# Altium project TECLADO-G5-5A.PrjPcb.PrjPcb
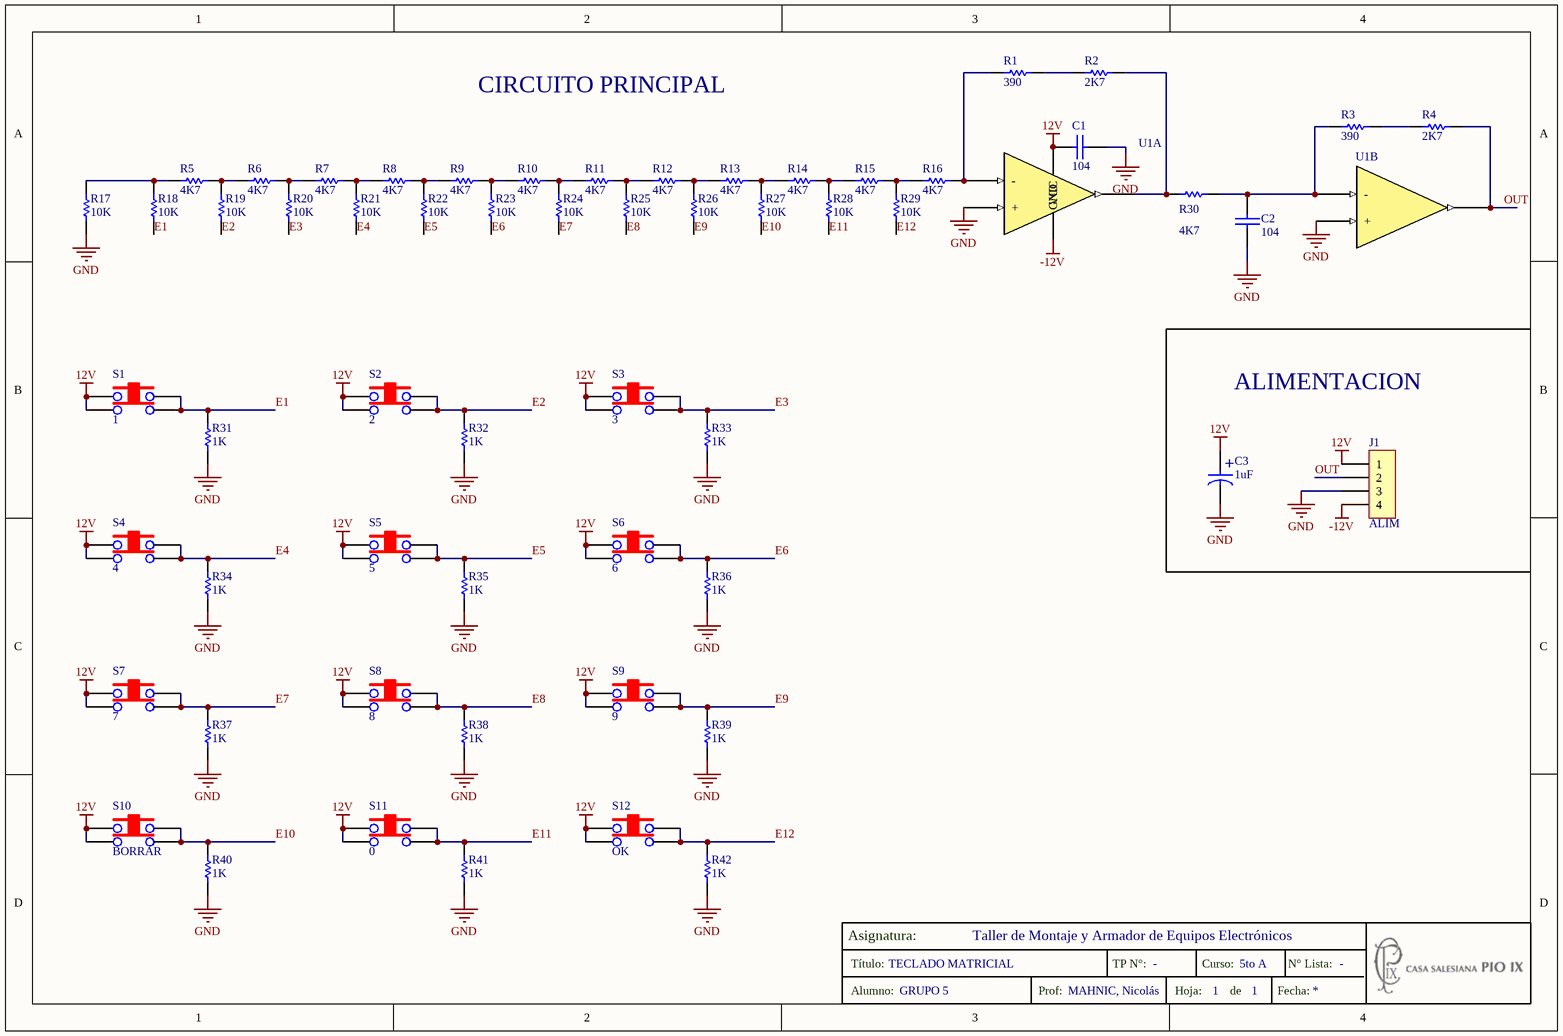
[diagram p0: TECLADO-G5-5A.schDoc.SchDoc]
1 sheet, 59 parts. Net scope: global (net labels, ports and power ports of the same name join across sheets).
Board file: TECLADO-G5-5A.pcbDoc.PcbDoc

## Sheet TECLADO-G5-5A.schDoc.SchDoc
size A4; SheetNumber: 1; SheetTotal: 1; Titulo: TECLADO MATRICIAL; Alumno: GRUPO 5; profesor: MAHNIC, Nicolás; curso: 5to A; TPN: -; NLista: -; Asignatura: Taller de Montaje y Armador de Equipos Electrónicos; Año: 2019; Rule: PcbType=ProtelPcb

### Parts
C1  104  [0805]
C2  104  [0805]
C3  1uF  [Capol]
J1  ALIM  [SIP4]
R1  390  [0805]
R2  2K7  [0805]
R3  390  [0805]
R4  2K7  [0805]
R5  4K7  [0805]
R6  4K7  [0805]
R7  4K7  [0805]
R8  4K7  [0805]
R9  4K7  [0805]
R10  4K7  [0805]
R11  4K7  [0805]
R12  4K7  [0805]
R13  4K7  [0805]
R14  4K7  [0805]
R15  4K7  [0805]
R16  4K7  [0805]
R17  10K  [0805]
R18  10K  [0805]
R19  10K  [0805]
R20  10K  [0805]
R21  10K  [0805]
R22  10K  [0805]
R23  10K  [0805]
R24  10K  [0805]
R25  10K  [0805]
R26  10K  [0805]
R27  10K  [0805]
R28  10K  [0805]
R29  10K  [0805]
R30  4K7  [0805]
R31  1K  [0805]
R32  1K  [0805]
R33  1K  [0805]
R34  1K  [0805]
R35  1K  [0805]
R36  1K  [0805]
R37  1K  [0805]
R38  1K  [0805]
R39  1K  [0805]
R40  1K  [0805]
R41  1K  [0805]
R42  1K  [0805]
S1  1  [pul_grande]
S2  2  [pul_grande]
S3  3  [pul_grande]
S4  4  [pul_grande]
S5  5  [pul_grande]
S6  6  [pul_grande]
S7  7  [pul_grande]
S8  8  [pul_grande]
S9  9  [pul_grande]
S10  BORRAR  [pul_grande]
S11  0  [pul_grande]
S12  OK  [pul_grande]
U1  (no value)  [LM358 SMD]  (parts A,B of 2)

### Nets
12V: C1.1 C3.1 J1.1 S1.1 S1.2 S2.1 S2.2 S3.1 S3.2 S4.1 S4.2 S5.1 S5.2 S6.1 S6.2 S7.1 S7.2 S8.1 S8.2 S9.1 S9.2 S10.1 S10.2 S11.1 S11.2 S12.1 S12.2 U1.8(VCC)
-12V: J1.4 U1.4(GND)
GND: C1.2 C2.2 C3.2 J1.3 R17.1 R31.1 R32.1 R33.1 R34.1 R35.1 R36.1 R37.1 R38.1 R39.1 R40.1 R41.1 R42.1 U1.3(+) U1.5(+)
E1: R18.1 R31.2 S1.3 S1.4
E2: R19.1 R32.2 S2.3 S2.4
E3: R20.1 R33.2 S3.3 S3.4
E4: R21.1 R34.2 S4.3 S4.4
E5: R22.1 R35.2 S5.3 S5.4
E6: R23.1 R36.2 S6.3 S6.4
E7: R24.1 R37.2 S7.3 S7.4
E8: R25.1 R38.2 S8.3 S8.4
E9: R26.1 R39.2 S9.3 S9.4
E10: R27.1 R40.2 S10.3 S10.4
E11: R28.1 R41.2 S11.3 S11.4
E12: R29.1 R42.2 S12.3 S12.4
OUT: J1.2 R4.1 U1.7(OUT_B)
NetC2_1: C2.1 R3.2 R30.1 U1.6(-)
NetR1_1: R1.1 R2.2
NetR1_2: R1.2 R16.1 U1.2(-)
NetR2_1: R2.1 R30.2 U1.1(OUT_A)
NetR3_1: R3.1 R4.2
NetR5_1: R5.1 R6.2 R19.2
NetR5_2: R5.2 R17.2 R18.2
NetR6_1: R6.1 R7.2 R20.2
NetR7_1: R7.1 R8.2 R21.2
NetR8_1: R8.1 R9.2 R22.2
NetR9_1: R9.1 R10.2 R23.2
NetR10_1: R10.1 R11.2 R24.2
NetR11_1: R11.1 R12.2 R25.2
NetR12_1: R12.1 R13.2 R26.2
NetR13_1: R13.1 R14.2 R27.2
NetR14_1: R14.1 R15.2 R28.2
NetR15_1: R15.1 R16.2 R29.2

### Notes on the sheet
- CIRCUITO PRINCIPAL
- ALIMENTACION
- Asignatura:
- Título:
- TP N°:
- Curso:
- N° Lista:
- Alumno:
- Prof:
- Hoja:
- de
- Fecha:
- (in symbol CAPPOL) +

### Library data of the parts
C1 C2 = CAP: Diodo 0805
C3 = CAPPOL: Cap polarizado
J1 = CON4
R1-R42 = RES: Resistencia
S1-S12 = Pulsador: Autor: Guido Spataro; Data: Libebal; Fecha: 07/04/19
U1 = LM358